# Altium schematic sheet 04_uart_i2c.SchDoc: =Proj_Title
size B; Address1: Giesshuebelstrasse 40; Address2: 8045 Zurich, Switzerland; SheetNumber: 4
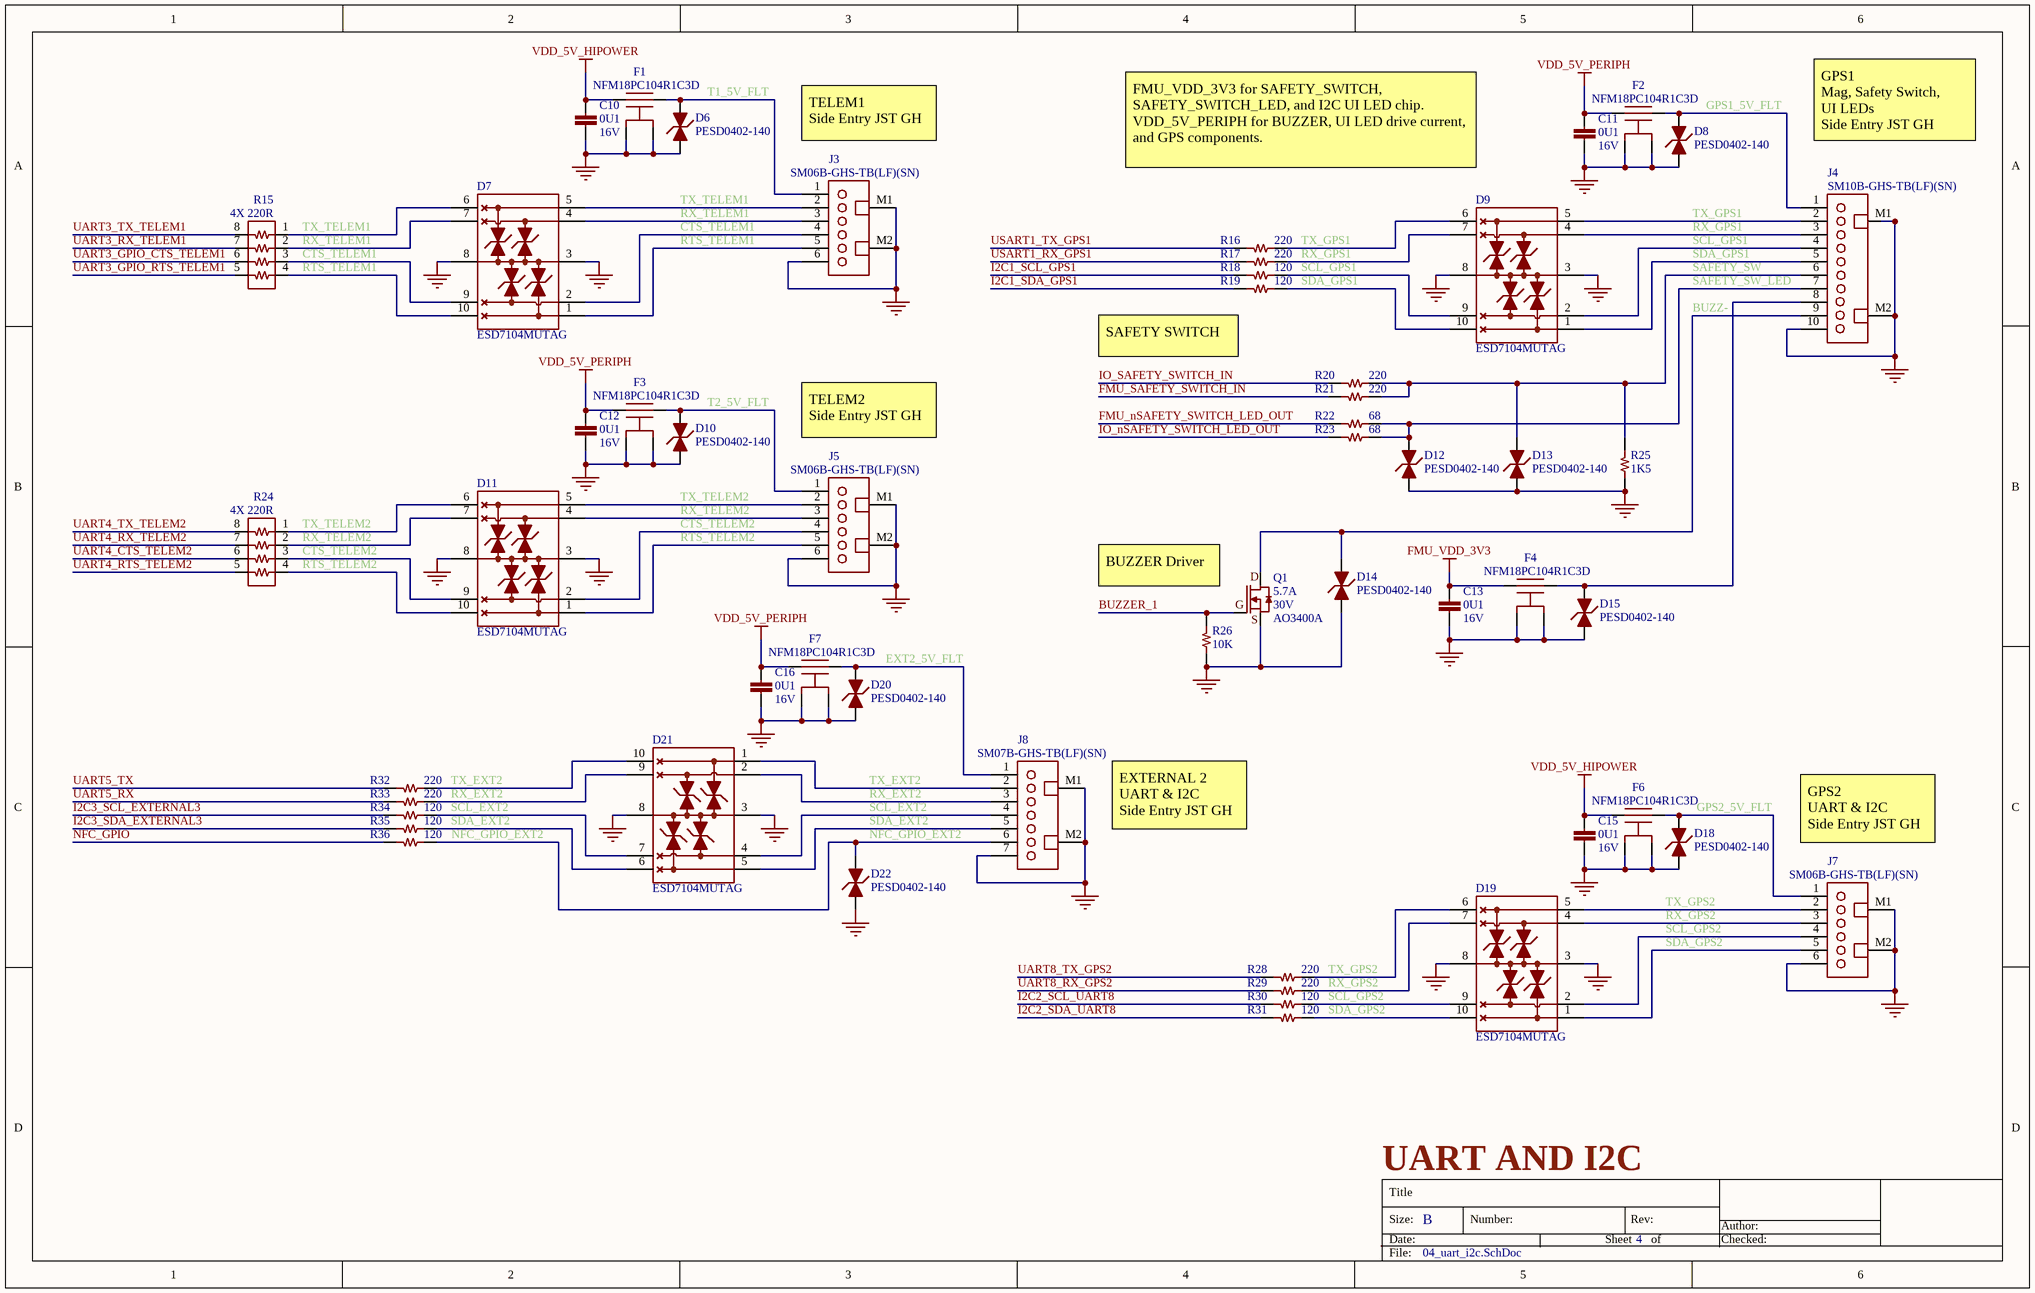
[diagram p0: 04_uart_i2c.SchDoc]

## Parts
C10  value 0U1  Voltage - Rated: 16V  [CAPC100X50X56L25N]  (hidden comment: CAP CER 0.1UF 10% 16V X7R 0402)
C11  value 0U1  Voltage - Rated: 16V  [CAPC100X50X56L25N]  (hidden comment: CAP CER 0.1UF 10% 16V X7R 0402)
C12  value 0U1  Voltage - Rated: 16V  [CAPC100X50X56L25N]  (hidden comment: CAP CER 0.1UF 10% 16V X7R 0402)
C13  value 0U1  Voltage - Rated: 16V  [CAPC100X50X56L25N]  (hidden comment: CAP CER 0.1UF 10% 16V X7R 0402)
C15  value 0U1  Voltage - Rated: 16V  [CAPC100X50X56L25N]  (hidden comment: CAP CER 0.1UF 10% 16V X7R 0402)
C16  value 0U1  Voltage - Rated: 16V  [CAPC100X50X56L25N]  (hidden comment: CAP CER 0.1UF 10% 16V X7R 0402)
D6  Manufacturer Part Number: PESD0402-140  [DIONC100X50X43L20N]  (hidden comment: DIODE TVS BIDIRECTIONAL 14VWM 40VC 0402)
D7  Manufacturer Part Number: ESD7104MUTAG  [UDFN10P50_250X100X55L35X20N]  (hidden comment: DIODE TVS BIDIRECTIONAL 5V 10V 10UDFN)
D8  Manufacturer Part Number: PESD0402-140  [DIONC100X50X43L20N]  (hidden comment: DIODE TVS BIDIRECTIONAL 14VWM 40VC 0402)
D9  Manufacturer Part Number: ESD7104MUTAG  [UDFN10P50_250X100X55L35X20N]  (hidden comment: DIODE TVS BIDIRECTIONAL 5V 10V 10UDFN)
D10  Manufacturer Part Number: PESD0402-140  [DIONC100X50X43L20N]  (hidden comment: DIODE TVS BIDIRECTIONAL 14VWM 40VC 0402)
D11  Manufacturer Part Number: ESD7104MUTAG  [UDFN10P50_250X100X55L35X20N]  (hidden comment: DIODE TVS BIDIRECTIONAL 5V 10V 10UDFN)
D12  Manufacturer Part Number: PESD0402-140  [DIONC100X50X43L20N]  (hidden comment: DIODE TVS BIDIRECTIONAL 14VWM 40VC 0402)
D13  Manufacturer Part Number: PESD0402-140  [DIONC100X50X43L20N]  (hidden comment: DIODE TVS BIDIRECTIONAL 14VWM 40VC 0402)
D14  Manufacturer Part Number: PESD0402-140  [DIONC100X50X43L20N]  (hidden comment: DIODE TVS BIDIRECTIONAL 14VWM 40VC 0402)
D15  Manufacturer Part Number: PESD0402-140  [DIONC100X50X43L20N]  (hidden comment: DIODE TVS BIDIRECTIONAL 14VWM 40VC 0402)
D18  Manufacturer Part Number: PESD0402-140  [DIONC100X50X43L20N]  (hidden comment: DIODE TVS BIDIRECTIONAL 14VWM 40VC 0402)
D19  Manufacturer Part Number: ESD7104MUTAG  [UDFN10P50_250X100X55L35X20N]  (hidden comment: DIODE TVS BIDIRECTIONAL 5V 10V 10UDFN)
D20  Manufacturer Part Number: PESD0402-140  [DIONC100X50X43L20N]  (hidden comment: DIODE TVS BIDIRECTIONAL 14VWM 40VC 0402)
D21  Manufacturer Part Number: ESD7104MUTAG  [UDFN10P50_250X100X55L35X20N]  (hidden comment: DIODE TVS BIDIRECTIONAL 5V 10V 10UDFN)
D22  Manufacturer Part Number: PESD0402-140  [DIONC100X50X43L20N]  (hidden comment: DIODE TVS BIDIRECTIONAL 14VWM 40VC 0402)
F1  Manufacturer Part Number: NFM18PC104R1C3D  [NFM18PC104R1C3_0603_NO_VIA]  (hidden comment: FILTER CAP FEEDTHRU 0.1UF 20% 16V 0603)
F2  Manufacturer Part Number: NFM18PC104R1C3D  [NFM18PC104R1C3_0603_NO_VIA]  (hidden comment: FILTER CAP FEEDTHRU 0.1UF 20% 16V 0603)
F3  Manufacturer Part Number: NFM18PC104R1C3D  [NFM18PC104R1C3_0603_NO_VIA]  (hidden comment: FILTER CAP FEEDTHRU 0.1UF 20% 16V 0603)
F4  Manufacturer Part Number: NFM18PC104R1C3D  [NFM18PC104R1C3_0603_NO_VIA]  (hidden comment: FILTER CAP FEEDTHRU 0.1UF 20% 16V 0603)
F6  Manufacturer Part Number: NFM18PC104R1C3D  [NFM18PC104R1C3_0603_NO_VIA]  (hidden comment: FILTER CAP FEEDTHRU 0.1UF 20% 16V 0603)
F7  Manufacturer Part Number: NFM18PC104R1C3D  [NFM18PC104R1C3_0603_NO_VIA]  (hidden comment: FILTER CAP FEEDTHRU 0.1UF 20% 16V 0603)
J3  Manufacturer Part Number: SM06B-GHS-TB(LF)(SN)  [JST_SM06B-GHS-TBLFSN]  (hidden comment: CONN HEADER GH SIDE 6POS 1.25MM SMT)
J4  Manufacturer Part Number: SM10B-GHS-TB(LF)(SN)  [JST_SM10B-GHS-TBLFSN]  (hidden comment: CONN HEADER GH 10POS SIDE 1.25MM SMT)
J5  Manufacturer Part Number: SM06B-GHS-TB(LF)(SN)  [JST_SM06B-GHS-TBLFSN]  (hidden comment: CONN HEADER GH SIDE 6POS 1.25MM SMT)
J7  Manufacturer Part Number: SM06B-GHS-TB(LF)(SN)  [JST_SM06B-GHS-TBLFSN]  (hidden comment: CONN HEADER GH SIDE 6POS 1.25MM SMT)
J8  Manufacturer Part Number: SM07B-GHS-TB(LF)(SN)  [JST_SM07B-GHS-TBLFSN]  (hidden comment: CONN HEADER GH 7POS SIDE 1.25MM SMT)
Q1  Current: 5.7A  Voltage: 30V  Manufacturer Part Number: AO3400A  [SOT23-3P95_230X110L30X43N]  (hidden comment: TRANSISTOR MOSFET N-CH 30V 5.7A SOT23)
R15  value 4X 220R  [RESCAF8P80_320X160X61L30X65N]  (hidden comment: RES ARRAY 4 RES 220 OHM 1206)
R16  value 220  [RESC100X50X40L25]  (hidden comment: RES SMD 220 OHM 1% 1/16W 0402)
R17  value 220  [RESC100X50X40L25]  (hidden comment: RES SMD 220 OHM 1% 1/16W 0402)
R18  value 120  [RESC100X50X40L25]  (hidden comment: RES SMD 120 OHM 1% 1/16W 0402)
R19  value 120  [RESC100X50X40L25]  (hidden comment: RES SMD 120 OHM 1% 1/16W 0402)
R20  value 220  [RESC100X50X40L25]  (hidden comment: RES SMD 220 OHM 1% 1/16W 0402)
R21  value 220  [RESC100X50X40L25]  (hidden comment: RES SMD 220 OHM 1% 1/16W 0402)
R22  value 68  [RESC100X50X40L25]  (hidden comment: RES SMD 68 OHM 1% 1/16W 0402)
R23  value 68  [RESC100X50X40L25]  (hidden comment: RES SMD 68 OHM 1% 1/16W 0402)
R24  value 4X 220R  [RESCAF8P80_320X160X61L30X65N]  (hidden comment: RES ARRAY 4 RES 220 OHM 1206)
R25  value 1K5  [RESC100X50X40L25]  (hidden comment: RES SMD 1.5K OHM 1% 1/16W 0402)
R26  value 10K  [RESC100X50X40L25]  (hidden comment: RES SMD 10K OHM 1% 1/16W 0402)
R28  value 220  [RESC100X50X40L25]  (hidden comment: RES SMD 220 OHM 1% 1/16W 0402)
R29  value 220  [RESC100X50X40L25]  (hidden comment: RES SMD 220 OHM 1% 1/16W 0402)
R30  value 120  [RESC100X50X40L25]  (hidden comment: RES SMD 120 OHM 1% 1/16W 0402)
R31  value 120  [RESC100X50X40L25]  (hidden comment: RES SMD 120 OHM 1% 1/16W 0402)
R32  value 220  [RESC100X50X40L25]  (hidden comment: RES SMD 220 OHM 1% 1/16W 0402)
R33  value 220  [RESC100X50X40L25]  (hidden comment: RES SMD 220 OHM 1% 1/16W 0402)
R34  value 120  [RESC100X50X40L25]  (hidden comment: RES SMD 120 OHM 1% 1/16W 0402)
R35  value 120  [RESC100X50X40L25]  (hidden comment: RES SMD 120 OHM 1% 1/16W 0402)
R36  value 120  [RESC100X50X40L25]  (hidden comment: RES SMD 120 OHM 1% 1/16W 0402)

## Nets
FMU_VDD_3V3: C13.1 F4.1
GND: C10.2 C11.2 C12.2 C13.2 C15.2 C16.2 D6.1 D7.3(GND) D7.8(GND) D8.1 D9.3(GND) D9.8(GND) D10.1 D11.3(GND) D11.8(GND) D12.1 D13.1 D14.1 D15.1 D18.1 D19.3(GND) D19.8(GND) D20.1 D21.3(GND) D21.8(GND) D22.1 F1.2A(GND) F1.2B(GND) F2.2A(GND) F2.2B(GND) F3.2A(GND) F3.2B(GND) F4.2A(GND) F4.2B(GND) F6.2A(GND) F6.2B(GND) F7.2A(GND) F7.2B(GND) J3.6 J3.M1 J3.M2 J4.10 J4.M1 J4.M2 J5.6 J5.M1 J5.M2 J7.6 J7.M1 J7.M2 J8.7 J8.M1 J8.M2 Q1.2(S) R25.2 R26.2
VDD_5V_HIPOWER: C10.1 C15.1 F1.1 F6.1
VDD_5V_PERIPH: C11.1 C12.1 C16.1 F2.1 F3.1 F7.1
BUZZ-: D14.2 J4.9 Q1.3(D)
BUZZER_1: Q1.1(G) R26.1
CTS_TELEM1: D7.2 D7.9(NC) J3.4 R15.3
CTS_TELEM2: D11.2 D11.9(NC) J5.4 R24.3
EXT2_5V_FLT: D20.2 F7.3 J8.1
FMU_nSAFETY_SWITCH_LED_OUT: R22.1
FMU_SAFETY_SWITCH_IN: R21.1
GPS1_5V_FLT: D8.2 F2.3 J4.1
GPS2_5V_FLT: D18.2 F6.3 J7.1
I2C1_SCL_GPS1: R18.1
I2C1_SDA_GPS1: R19.1
I2C2_SCL_UART8: R30.1
I2C2_SDA_UART8: R31.1
I2C3_SCL_EXTERNAL3: R34.1
I2C3_SDA_EXTERNAL3: R35.1
IO_nSAFETY_SWITCH_LED_OUT: R23.1
IO_SAFETY_SWITCH_IN: R20.1
NFC_GPIO: R36.1
NFC_GPIO_EXT2: D22.2 J8.6 R36.2
RTS_TELEM1: D7.1 D7.10(NC) J3.5 R15.4
RTS_TELEM2: D11.1 D11.10(NC) J5.5 R24.4
RX_EXT2: D21.2 D21.9(NC) J8.3 R33.2
RX_GPS1: D9.4 D9.7(NC) J4.3 R17.2
RX_GPS2: D19.4 D19.7(NC) J7.3 R29.2
RX_TELEM1: D7.4 D7.7(NC) J3.3 R15.2
RX_TELEM2: D11.4 D11.7(NC) J5.3 R24.2
SAFETY_SW: D13.2 J4.6 R20.2 R21.2 R25.1
SAFETY_SW_LED: D12.2 J4.7 R22.2 R23.2
SCL_EXT2: D21.4 D21.7(NC) J8.4 R34.2
SCL_GPS1: D9.2 D9.9(NC) J4.4 R18.2
SCL_GPS2: D19.2 D19.9(NC) J7.4 R30.2
SDA_EXT2: D21.5 D21.6(NC) J8.5 R35.2
SDA_GPS1: D9.1 D9.10(NC) J4.5 R19.2
SDA_GPS2: D19.1 D19.10(NC) J7.5 R31.2
T1_5V_FLT: D6.2 F1.3 J3.1
T2_5V_FLT: D10.2 F3.3 J5.1
TX_EXT2: D21.1 D21.10(NC) J8.2 R32.2
TX_GPS1: D9.5 D9.6(NC) J4.2 R16.2
TX_GPS2: D19.5 D19.6(NC) J7.2 R28.2
TX_TELEM1: D7.5 D7.6(NC) J3.2 R15.1
TX_TELEM2: D11.5 D11.6(NC) J5.2 R24.1
UART3_GPIO_CTS_TELEM1: R15.6
UART3_GPIO_RTS_TELEM1: R15.5
UART3_RX_TELEM1: R15.7
UART3_TX_TELEM1: R15.8
UART4_CTS_TELEM2: R24.6
UART4_RTS_TELEM2: R24.5
UART4_RX_TELEM2: R24.7
UART4_TX_TELEM2: R24.8
UART5_RX: R33.1
UART5_TX: R32.1
UART8_RX_GPS2: R29.1
UART8_TX_GPS2: R28.1
USART1_RX_GPS1: R17.1
USART1_TX_GPS1: R16.1
NetD15_2: D15.2 F4.3 J4.8

## Notes on the sheet
- TELEM1
  Side Entry JST GH
- FMU_VDD_3V3 for SAFETY_SWITCH, SAFETY_SWITCH_LED, and I2C UI LED chip.
  VDD_5V_PERIPH for BUZZER, UI LED drive current, and GPS components.
- GPS1
  Mag, Safety Switch,
  UI LEDs
  Side Entry JST GH
- SAFETY SWITCH
- TELEM2
  Side Entry JST GH
- BUZZER Driver
- EXTERNAL 2
  UART & I2C
  Side Entry JST GH
- GPS2
  UART & I2C
  Side Entry JST GH
- UART AND I2C
- Title
- Size:
- Date:
- B
- Number:
- Sheet
- Rev:
- of
- Author:
- Checked:
- File:

## Library data of the parts
C10-C13 C15 C16 = CAP_0U1_16V_X7R_0402: Manufacturer: Murata Electronics; Manufacturer Part Number: GCM155R71C104KA55J; Packaging: Cut Tape (CT); Part Status: Active; Tolerance: ±10%; Operating Temperature: -55°C ~ 125°C; Supplier 1: Digi-Key; Supplier Part Number 1: 490-7998-1-ND; Category: Capacitors; Stock 1: 6381653; Pricing 1: 1=0.1, 10=0.049, 100=0.022, 500=0.0157, 1000=0.01233, 2500=0.01121, 5000=0.01032 (USD); ComponentLink1Description: https://www.digikey.com/product-detail/en/murata-electronics/GCM155R71C104KA55J/490-7998-1-ND/4380283; ComponentLink1URL: https://www.digikey.com/product-detail/en/murata-electronics/GCM155R71C104KA55J/490-7998-1-ND/4380283
D6 D8 D10 D12-D15 D18 D20 D22 = DIODE_TVS_0402: Manufacturer: Littelfuse Inc.; Packaging: Cut Tape (CT); Part Status: Active; Operating Temperature: -55°C ~ 125°C (TJ); ComponentLink1URL: https://www.digikey.com/products/en/circuit-protection/tvs-diodes/144?k=PESD0402-140&k=&pkeyword=PESD0402-140&pv7=2&sf=0&quantity=&ColumnSort=0&page=1&pageSize=25; ComponentLink1Description: https://www.digikey.com/products/en/circuit-protection/tvs-diodes/144?k=PESD0402-140&k=&pkeyword=PESD0402-140&pv7=2&sf=0&quantity=&ColumnSort=0&page=1&pageSize=25; Supplier 1: Digi-Key; Supplier Part Number 1: PESD0402-140CT-ND; Category: Circuit Protection; Stock 1: 281442; Pricing 1: 10000=0.13154, 30000=0.12096 (USD)
D7 D9 D11 D19 D21 = DIODE_TVS_4X_10UDFN: Manufacturer: ON Semiconductor; Packaging: Cut Tape (CT); Part Status: Active; Operating Temperature: -55°C ~ 125°C (TJ); Supplier 1: Digi-Key; Supplier Part Number 1: ESD7104MUTAGOSCT-ND; Category: Circuit Protection; Stock 1: 5750; Pricing 1: 1=0.63, 10=0.541, 100=0.40370, 500=0.31716, 1000=0.24508 (USD); ComponentLink1Description: https://www.digikey.com/product-detail/en/on-semiconductor/ESD7104MUTAG/ESD7104MUTAGOSCT-ND/3487538; ComponentLink1URL: https://www.digikey.com/product-detail/en/on-semiconductor/ESD7104MUTAG/ESD7104MUTAGOSCT-ND/3487538
F1-F4 F6 F7 = FILTER_0.1uF_16V_2A_NO_VIA_0603: Manufacturer: Murata Electronics North America; Packaging: Cut Tape (CT); Part Status: Active; Tolerance: ±20%; Voltage - Rated: 16V; Operating Temperature: -55°C ~ 125°C; Supplier 1: Digi-Key; Supplier Part Number 1: 490-6969-1-ND; Category: Filters; Stock 1: 172860; Pricing 1: 1=0.19, 10=0.173, 25=0.1652, 50=0.1598, 100=0.1544, 250=0.1464, 500=0.12246, 1000=0.09503 (USD); ComponentLink1Description: https://www.digikey.com/products/en/filters/feed-through-capacitors/845?k=NFM18PC104R1C3D&k=&pkeyword=NFM18PC104R1C3D&pv7=2&sf=0&quantity=&ColumnSort=0&page=1&pageSize=25; ComponentLink1URL: https://www.digikey.com/products/en/filters/feed-through-capacitors/845?k=NFM18PC104R1C3D&k=&pkeyword=NFM18PC104R1C3D&pv7=2&sf=0&quantity=&ColumnSort=0&page=1&pageSize=25
J3 J5 J7 = CONN_JST_GH_6PIN_RA_SMT: Manufacturer: JST Sales America Inc.; Voltage - Rated: 50V; System: Connector; Packaging: Cut Tape (CT); Part Status: Active; Operating Temperature: -25°C ~ 85°C; Supplier 1: Digi-Key; Supplier Part Number 1: 455-1568-1-ND; Category: Connectors, Interconnects; Stock 1: 86653; Pricing 1: 1=0.56, 10=0.524, 100=0.4019, 500=0.34948, 1000=0.28832 (USD); ComponentLink1Description: https://www.digikey.com/products/en/connectors-interconnects/rectangular-connectors-headers-male-pins/314?k=sm06b-ghs&k=&pkeyword=sm06b-ghs&pv7=2&sf=0&quantity=&ColumnSort=0&page=1&pageSize=25; ComponentLink1URL: https://www.digikey.com/products/en/connectors-interconnects/rectangular-connectors-headers-male-pins/314?k=sm06b-ghs&k=&pkeyword=sm06b-ghs&pv7=2&sf=0&quantity=&ColumnSort=0&page=1&pageSize=25
J4 = CONN_JST_GH_10PIN_RA_SMT: Manufacturer: JST Sales America Inc.; Voltage - Rated: 50V; System: Connector; Packaging: Cut Tape (CT); Part Status: Active; Operating Temperature: -25°C ~ 85°C; Supplier 1: Digi-Key; Supplier Part Number 1: 455-1572-1-ND; Category: Connectors, Interconnects; Stock 1: 58307; Pricing 1: 1=0.67, 10=0.631, 100=0.4838, 500=0.42068, 1000=0.34705 (USD); ComponentLink1Description: https://www.digikey.com/products/en/connectors-interconnects/rectangular-connectors-headers-male-pins/314?k=sm10b-gh&k=&pkeyword=sm10b-gh&pv7=2&sf=0&quantity=&ColumnSort=0&page=1&pageSize=25; ComponentLink1URL: https://www.digikey.com/products/en/connectors-interconnects/rectangular-connectors-headers-male-pins/314?k=sm10b-gh&k=&pkeyword=sm10b-gh&pv7=2&sf=0&quantity=&ColumnSort=0&page=1&pageSize=25
J8 = CONN_JST_GH_7PIN_RA_SMT: Manufacturer: JST Sales America Inc.; Voltage - Rated: 50V; System: Connector; Packaging: Cut Tape (CT); Part Status: Active; Operating Temperature: -25°C ~ 85°C; Supplier 1: Digi-Key; Supplier Part Number 1: 455-1569-1-ND; Category: Connectors, Interconnects; Stock 1: 37832; Pricing 1: 1=0.59, 10=0.548, 100=0.4205, 500=0.36564 1000=0.30165 (USD); ComponentLink1Description: https://www.digikey.com/product-detail/en/jst-sales-america-inc/SM07B-GHS-TB-LF-SN/455-1569-1-ND/807837; ComponentLink1URL: https://www.digikey.com/product-detail/en/jst-sales-america-inc/SM07B-GHS-TB-LF-SN/455-1569-1-ND/807837
Q1 = TRAN_MOSFET_N-CH_AO3400A_SMT: Manufacturer: Alpha & Omega Semiconductor Inc.; Packaging: Cut Tape (CT); Part Status: Active; Supplier 1: Digi-Key; Supplier Part Number 1: 785-1000-1-ND; Category: Discrete Semiconductor Products; Stock 1: 545345; Pricing 1: 1=0.49, 10=0.354, 100=0.2359, 500=0.14414, 1000=0.11356 (USD); ComponentLink1Description: https://www.digikey.com/products/en/discrete-semiconductor-products/transistors-fets-mosfets-single/278?k=&pkeyword=&pv2068=u30V&pv608=2552&sf=0&FV=ffe00116%2Cfffc0311%2C1c0002&quantity=&ColumnSort=0&page=1&pageSize=25; ComponentLink1URL: https://www.digikey.com/products/en/discrete-semiconductor-products/transistors-fets-mosfets-single/278?k=&pkeyword=&pv2068=u30V&pv608=2552&sf=0&FV=ffe00116%2Cfffc0311%2C1c0002&quantity=&ColumnSort=0&page=1&pageSize=25
R15 R24 = RES_ARRAY_220_5%_1/16W_1206: Manufacturer: Yageo; Manufacturer Part Number: YC164-JR-07220RL; Tolerance: ±5%; Power: 1/16W; Packaging: Cut Tape (CT); Part Status: Active; Operating Temperature: -55°C ~ 155°C; Supplier 1: Digi-Key; Supplier Part Number 1: YC164J-220CT-ND; Category: Resistors; Stock 1: 17927; Pricing 1: 1=0.1, 10=0.014, 100=0.0056, 1000=0.00253, 2500=0.0022, 5000=0.00181 (USD); ComponentLink1Description: https://www.digikey.com/products/en/resistors/resistor-networks-arrays/50?k=&pkeyword=&pv16=9574&sf=0&FV=fffc000d%2C1c0002%2C1f140000%2C24280001%2Cffe00032%2C40136&quantity=&ColumnSort=0&page=1&pageSize=25; ComponentLink1URL: https://www.digikey.com/products/en/resistors/resistor-networks-arrays/50?k=&pkeyword=&pv16=9574&sf=0&FV=fffc000d%2C1c0002%2C1f140000%2C24280001%2Cffe00032%2C40136&quantity=&ColumnSort=0&page=1&pageSize=25
R16 R17 R20 R21 R28 R29 R32 R33 = RES_220_1%_1/16W_0402: Manufacturer: Yageo; Manufacturer Part Number: RC0402FR-07220RL; Category: Resistors; Packaging: Cut Tape (CT); Part Status: Active; Tolerance: ±1%; Power: 1/16W; Operating Temperature: -55°C ~ 155°C; ComponentLink1URL: https://www.digikey.com/products/en/resistors/chip-resistor-surface-mount/52?k=RC0402FR-07220RL&k=&pkeyword=RC0402FR-07220RL&pv7=2&sf=0&quantity=&ColumnSort=0&page=1&pageSize=25; ComponentLink1Description: https://www.digikey.com/products/en/resistors/chip-resistor-surface-mount/52?k=RC0402FR-07220RL&k=&pkeyword=RC0402FR-07220RL&pv7=2&sf=0&quantity=&ColumnSort=0&page=1&pageSize=25; Supplier 1: Digi-Key; Supplier Part Number 1: 311-220LRCT-ND; Stock 1: 897942; Pricing 1: 1=0.1, 10=0.014, 100=0.0056, 1000=0.00253, 2500=0.0022, 5000=0.00181 (USD)
R18 R19 R30 R31 R34-R36 = RES_120_1%_1/16W_0402: Manufacturer: Yageo; Manufacturer Part Number: RC0402FR-07120RL; Category: Resistors; Packaging: Cut Tape (CT); Part Status: Active; Tolerance: ±1%; Operating Temperature: -55°C ~ 155°C; Supplier 1: Digi-Key; Supplier Part Number 1: 311-120LRCT-ND; Stock 1: 607269; Pricing 1: 1=0.1, 10=0.014, 100=0.0056, 1000=0.00253, 2500=0.0022, 5000=0.00181 (USD); Power: 1/16W; ComponentLink1Description: https://www.digikey.com/products/en/resistors/chip-resistor-surface-mount/52?k=RC0402FR-07120RL&k=&pkeyword=RC0402FR-07120RL&pv7=2&sf=0&quantity=&ColumnSort=0&page=1&pageSize=25; ComponentLink1URL: https://www.digikey.com/products/en/resistors/chip-resistor-surface-mount/52?k=RC0402FR-07120RL&k=&pkeyword=RC0402FR-07120RL&pv7=2&sf=0&quantity=&ColumnSort=0&page=1&pageSize=25
R22 R23 = RES_68R_1%_1/16W_0402: Manufacturer: Yageo; Manufacturer Part Number: AC0402FR-0768RL; Category: Resistors; Packaging: Cut Tape (CT); Part Status: Active; Tolerance: ±1%; Operating Temperature: -55°C ~ 155°C; Supplier 1: Digi-Key; Stock 1: 59902; Pricing 1: 1=0.1, 10=0.014, 100=0.0056, 1000=0.00253, 2500=0.0022, 5000=0.00181 (USD); Power: 1/16W; Supplier Part Number 1: YAG3507CT-ND; ComponentLink1Description: https://www.digikey.com/product-detail/en/yageo/AC0402FR-0768RL/YAG3507CT-ND/6006356; ComponentLink1URL: https://www.digikey.com/product-detail/en/yageo/AC0402FR-0768RL/YAG3507CT-ND/6006356
R25 = RES_1K5_1%_1/16W_0402: Manufacturer: Yageo; Manufacturer Part Number: RC0402FR-071K5L; Packaging: Cut Tape (CT); Part Status: Active; Tolerance: ±1%; Operating Temperature: -55°C ~ 155°C; Supplier 1: Digi-Key; Supplier Part Number 1: 311-1.50KLRCT-ND; Category: Resistors; Stock 1: 2210206; Pricing 1: 1=0.1, 10=0.014, 100=0.0056, 1000=0.00253, 2500=0.0022, 5000=0.00181 (USD); Power: 1/16W; ComponentLink1Description: https://www.digikey.com/products/en/resistors/chip-resistor-surface-mount/52?k=RC0402FR-071K5L&k=&pkeyword=RC0402FR-071K5L&pv7=2&sf=0&quantity=&ColumnSort=0&page=1&pageSize=25; ComponentLink1URL: https://www.digikey.com/products/en/resistors/chip-resistor-surface-mount/52?k=RC0402FR-071K5L&k=&pkeyword=RC0402FR-071K5L&pv7=2&sf=0&quantity=&ColumnSort=0&page=1&pageSize=25
R26 = RES_10K_1%_1/16W_0402: Manufacturer: Vishay Dale; Manufacturer Part Number: CRCW040210K0FKED; Packaging: Cut Tape (CT); Part Status: Active; Tolerance: ±1%; Operating Temperature: -55°C ~ 155°C; ComponentLink1URL: https://www.digikey.com/products/en?keywords=311-10.0KLRCT-ND; ComponentLink1Description: https://www.digikey.com/products/en?keywords=311-10.0KLRCT-ND; Supplier 1: Digi-Key; Supplier Part Number 1: 541-10.0KLCT-ND; Category: Resistors; Stock 1: 37996194; Pricing 1: 1=0.1, 10=0.014, 100=0.0056, 1000=0.00253, 2500=0.0022, 5000=0.00181 (USD); Power: 1/16W